# Altium schematic sheet Mech_Arm_Controller.SchDoc
size A4
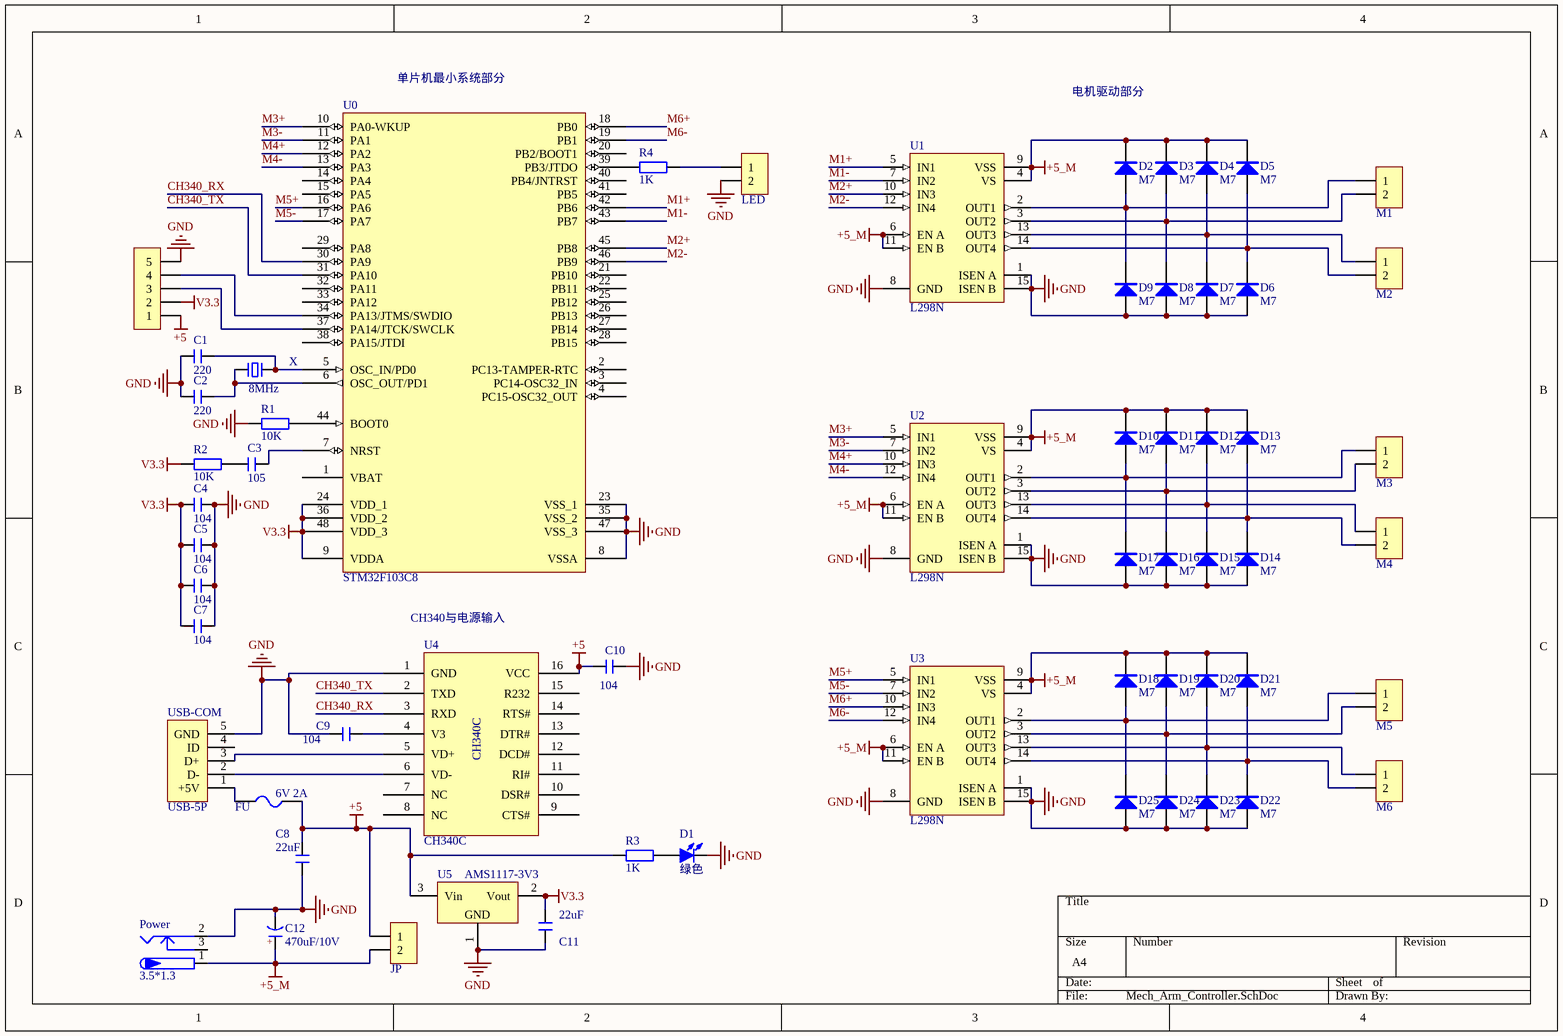
[diagram p0: Mech_Arm_Controller.SchDoc]

## Parts
5_3_C_D_G  HDR-1X5  [HDR2.54-LI-5P]  (value not drawn)
C1  220  [C 0603_L]
C2  220  [C 0603_L]
C3  105  [C 0603_L]
C4  104  [C 0603_L]
C5  104  [C 0603_L]
C6  104  [C 0603_L]
C7  104  [C 0603_L]
C8  22uF  [C 0805_L]
C9  104  [C 0603_L]
C10  104  [C 0603_L]
C11  22uF  [C 0805_L]
C12  470uF/10V  [CM D(6.3*7.7)]
D1  绿色  [LED 0805G]
D2  M7  [SMA]
D3  M7  [SMA]
D4  M7  [SMA]
D5  M7  [SMA]
D6  M7  [SMA]
D7  M7  [SMA]
D8  M7  [SMA]
D9  M7  [SMA]
D10  M7  [SMA]
D11  M7  [SMA]
D12  M7  [SMA]
D13  M7  [SMA]
D14  M7  [SMA]
D15  M7  [SMA]
D16  M7  [SMA]
D17  M7  [SMA]
D18  M7  [SMA]
D19  M7  [SMA]
D20  M7  [SMA]
D21  M7  [SMA]
D22  M7  [SMA]
D23  M7  [SMA]
D24  M7  [SMA]
D25  M7  [SMA]
FU  6V 2A  [FU 1812]
JP  HDR-1X2  [HDR2.54-LI-2P]  (value not drawn)
LED  HDR-1X2  [HDR2.54-LI-2P]  (value not drawn)
M1  HDR-1X2  [XH2.54-LI-2P]  (value not drawn)
M2  HDR-1X2  [XH2.54-LI-2P]  (value not drawn)
M3  HDR-1X2  [XH2.54-LI-2P]  (value not drawn)
M4  HDR-1X2  [XH2.54-LI-2P]  (value not drawn)
M5  HDR-1X2  [XH2.54-LI-2P]  (value not drawn)
M6  HDR-1X2  [XH2.54-LI-2P]  (value not drawn)
Power  3.5*1.3  [DC-005]
R1  10K  [R 0603_L]
R2  10K  [R 0603_L]
R3  1K  [R 0603_L]
R4  1K  [R 0603_L]
U0  STM32F103C8  [LQFP48 7X7_M]
U1  L298N  [L298N散热片]
U2  L298N  [L298N散热片]
U3  L298N  [L298N散热片]
U4  CH340C  [SOP16_N]
U5  AMS1117-3V3  [SOT223_L]
USB-COM  USB-5P  [USB-MICRO_A]
X  8MHz  [OSC HC-49SMD]

## Nets
+5: 5_3_C_D_G.1 C8.2 C10.1 FU.2 JP.1 R3.2 U4.16(VCC) U5.3(Vin)
+5_M: C12.1(A) D2.2(K) D3.2(K) D4.2(K) D5.2(K) D10.2(K) D11.2(K) D12.2(K) D13.2(K) D18.2(K) D19.2(K) D20.2(K) D21.2(K) JP.2 Power.1 U1.4(VS) U1.6(EN_A) U1.9(VSS) U1.11(EN_B) U2.4(VS) U2.6(EN_A) U2.9(VSS) U2.11(EN_B) U3.4(VS) U3.6(EN_A) U3.9(VSS) U3.11(EN_B)
GND: 5_3_C_D_G.5 C1.1 C2.1 C4.2 C5.2 C6.2 C7.2 C8.1 C9.2 C10.2 C11.1 C12.2(K) D1.2(K) D6.1(A) D7.1(A) D8.1(A) D9.1(A) D14.1(A) D15.1(A) D16.1(A) D17.1(A) D22.1(A) D23.1(A) D24.1(A) D25.1(A) LED.2 Power.2 R1.1 U0.8(VSSA) U0.23(VSS_1) U0.35(VSS_2) U0.47(VSS_3) U1.1(ISEN_A) U1.8(GND) U1.15(ISEN_B) U2.1(ISEN_A) U2.8(GND) U2.15(ISEN_B) U3.1(ISEN_A) U3.8(GND) U3.15(ISEN_B) U4.1(GND) U5.1(GND) USB-COM.5(GND)
V3.3: 5_3_C_D_G.2 C4.1 C5.1 C6.1 C7.1 C11.2 R2.1 U0.9(VDDA) U0.24(VDD_1) U0.36(VDD_2) U0.48(VDD_3) U5.2(Vout)
CH340_RX: U0.30(PA9) U4.3(RXD)
CH340_TX: U0.31(PA10) U4.2(TXD)
M1+: U0.42(PB6) U1.5(IN1)
M1-: U0.43(PB7) U1.7(IN2)
M2+: U0.45(PB8) U1.10(IN3)
M2-: U0.46(PB9) U1.12(IN4)
M3+: U0.10(PA0-WKUP) U2.5(IN1)
M3-: U0.11(PA1) U2.7(IN2)
M4+: U0.12(PA2) U2.10(IN3)
M4-: U0.13(PA3) U2.12(IN4)
M5+: U0.16(PA6) U3.5(IN1)
M5-: U0.17(PA7) U3.7(IN2)
M6+: U0.18(PB0) U3.10(IN3)
M6-: U0.19(PB1) U3.12(IN4)
Net5_3_C_D_G_3: 5_3_C_D_G.3 U0.37(PA14/JTCK/SWCLK)
Net5_3_C_D_G_4: 5_3_C_D_G.4 U0.34(PA13/JTMS/SWDIO)
NetC1_2: C1.2 U0.5(OSC_IN/PD0) X.2
NetC2_2: C2.2 U0.6(OSC_OUT/PD1) X.1
NetC3_1: C3.1 R2.2
NetC3_2: C3.2 U0.7(NRST)
NetC9_1: C9.1 U4.4(V3)
NetD1_1: D1.1(A) R3.1
NetD2_1: D2.1(A) D9.2(K) M1.1 U1.2(OUT1)
NetD3_1: D3.1(A) D8.2(K) M1.2 U1.3(OUT2)
NetD4_1: D4.1(A) D7.2(K) M2.1 U1.13(OUT3)
NetD5_1: D5.1(A) D6.2(K) M2.2 U1.14(OUT4)
NetD10_1: D10.1(A) D17.2(K) M3.1 U2.2(OUT1)
NetD11_1: D11.1(A) D16.2(K) M3.2 U2.3(OUT2)
NetD12_1: D12.1(A) D15.2(K) M4.1 U2.13(OUT3)
NetD13_1: D13.1(A) D14.2(K) M4.2 U2.14(OUT4)
NetD18_1: D18.1(A) D25.2(K) M5.1 U3.2(OUT1)
NetD19_1: D19.1(A) D24.2(K) M5.2 U3.3(OUT2)
NetD20_1: D20.1(A) D23.2(K) M6.1 U3.13(OUT3)
NetD21_1: D21.1(A) D22.2(K) M6.2 U3.14(OUT4)
NetFU_1: FU.1 USB-COM.1(+5V)
NetLED_1: LED.1 R4.2
NetR1_2: R1.2 U0.44(BOOT0)
NetR4_1: R4.1 U0.39(PB3/JTDO)
NetU4_5: U4.5(VD+) USB-COM.3(D+)
NetU4_6: U4.6(VD-) USB-COM.2(D-)

Not connected (* = marked no-connect by the designer): Power 3; U0 1(VBAT) 2(PC13-TAMPER-RTC) 3(PC14-OSC32_IN) 4(PC15-OSC32_OUT) 14(PA4) 15(PA5) 20(PB2/BOOT1) 21(PB10) 22(PB11) 25(PB12) 26(PB13) 27(PB14) 28(PB15) 29(PA8) 32(PA11) 33(PA12) 38(PA15/JTDI) 40(PB4/JNTRST) 41(PB5); U4 7(NC) 8(NC) 9(CTS#) 10(DSR#) 11(RI#) 12(DCD#) 13(DTR#) 14(RTS#) 15(R232); USB-COM 4(ID)

## Notes on the sheet
- (near U0) 单片机最小系统部分
- 电机驱动部分
- CH340与电源输入
- (in symbol C-CM) +

## Library data of the parts
5_3_C_D_G = Header 5: 5P接插件; 版权归属: 源创客; BOM名称: 5P接插件; 学习资源: www.ooocke.com
C1-C11 = C: 无极性贴片电容; 版权归属: 源创客; BOM名称: 无极性贴片电容; 学习资源: www.ooocke.com
C12 = C-CM: 贴片电解电容; 版权归属: 源创客; BOM名称: 贴片电解电容; 学习资源: www.ooocke.com
D1 = LED-SMD: 贴片LED; 版权归属: 源创客; BOM名称: 贴片LED; 学习资源: www.ooocke.com
D2-D25 = M7: 整流二极管; 版权归属: 源创客; BOM名称: 整流二极管; 学习资源: www.ooocke.com
FU = FU: 贴片保险丝; 版权归属: 源创客; BOM名称: 贴片保险丝; 学习资源: www.ooocke.com
JP LED M1-M6 = Header 2: 2P接插件; 版权归属: 源创客; BOM名称: 2P接插件; 学习资源: www.ooocke.com
Power = P-DC: 低压电源接口; BOM名称: DC电源接口; 版权归属: 源创客; 学习资源: www.ooocke.com
R1-R4 = R: 贴片电阻; 版权归属: 源创客; BOM名称: 贴片电阻; 学习资源: www.ooocke.com
U0 = STM32F103C8: Flaah:64/RAM:20/IO:36; BOM名称: 32位STM单片机; 版权归属: 源创客; 学习资源: www.ooocke.com
U1-U3 = L298N: Dual Full Bridge Driver; Published: 8-Jun-2000; LatestRevisionDate: 17-Jul-2002; LatestRevisionNote: Re-released for DXP Platform.; DatasheetDocument: Jul-1999; PackageDocument: Apr-1998; PackageReference: Multiwatt15H; Publisher: Altium Limited
U5 = AMS1117: 三端稳压芯片; BOM名称: 稳压芯片; 版权归属: 源创客; 学习资源: www.ooocke.com
USB-COM = USB-5P: 微型USB母座; 版权归属: 源创客; BOM名称: 微型USB母座; 学习资源: www.ooocke.com
X = XTAL-2P: 2脚无源脚晶振; 版权归属: 源创客; BOM名称: 2脚无源脚晶振; 学习资源: www.ooocke.com